# Altium schematic sheet SunS_Structure_Thermometer.SchDoc: Structure thermometer
size A4; PageSetup: Record=PageOptions|CenterHorizontal=True|CenterVertical=True|PrintScale=1.00|XCorrection=1.00|YCorrection=1.00|PrintKind=0|BorderSize=5000000|LeftOffset=0|BottomOffset=0|Orientation=2|PaperLength=1000|PaperWidth=1000|Scale=100|PaperSource=7|PrintQuality=-3|MediaType=1|DitherType=10|PrintScaleMode=1|PaperKind=A4|PaperIndex=9
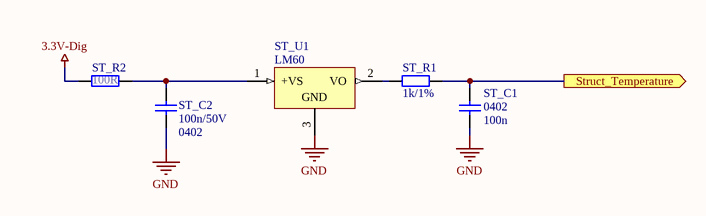
[diagram p0: SunS_Structure_Thermometer.SchDoc]

## Parts
ST_C1  0402  value 100n  [SMD_Capacitor_0402]
ST_C2  Package: 0402  [SMD_Capacitor_0402]  (hidden comment: 100n/50V)
ST_R1  1k/1%  [SMD_Resistor_0402]
ST_R2  100R  [SMD_Resistor_0402]
ST_U1  LM60  [SOT23-3]

## Ports
Struct_Temperature (out)

## Nets
3.3V-Dig: ST_R2.1
GND: ST_C1.1 ST_C2.2 ST_U1.3(GND)
Struct_Temperature: ST_C1.2 ST_R1.2 ; port Struct_Temperature
NetST_C2_1: ST_C2.1 ST_R2.2 ST_U1.1(+VS)
NetST_R1_1: ST_R1.1 ST_U1.2(VO)

## Notes on the sheet
- Title:
- Project:
- Author:
- Model:
- Document Number:
- Checked by:
- Rev:
- Date:
- Approved by:
- Sheet:
- of
- File name:

## Library data of the parts
ST_C1 = Cap: Capacitor; Published: 8-Jun-2000; LatestRevisionDate: 17-Jul-2002; LatestRevisionNote: Re-released for DXP Platform.; PackageReference: RAD-0.3; Publisher: Altium Limited; PackageDescription: Radial Cap, Thru-Hole; 2 Leads; 0.3 in Pin Spacing
ST_C2 = Cer_C0402T103K5RALTU: Ceramic Cap Kemet COTS 10n/50V X7R 0402; ManufacturerPartNumber: C0402T103K5RALTU; Manufacturer: Kemet; Value: 100n/50V
ST_R1 ST_R2 = CRCW04021K00FKxxxx: 1k/1% Vishay CRCW 0402 Resistor. 63mW, 100ppm, 50V.; Manufacturer: Vishay; ManufacturerPartNumber: CRCW04021K00FKxxxx; Package: 0402
  ST_R1: Value: 1k/1%
  ST_R2: Value: 100R
ST_U1 = LM60: Analog temperature sensor